# EAGLE design drehgeber_v1 (EAGLE 7.5.0)
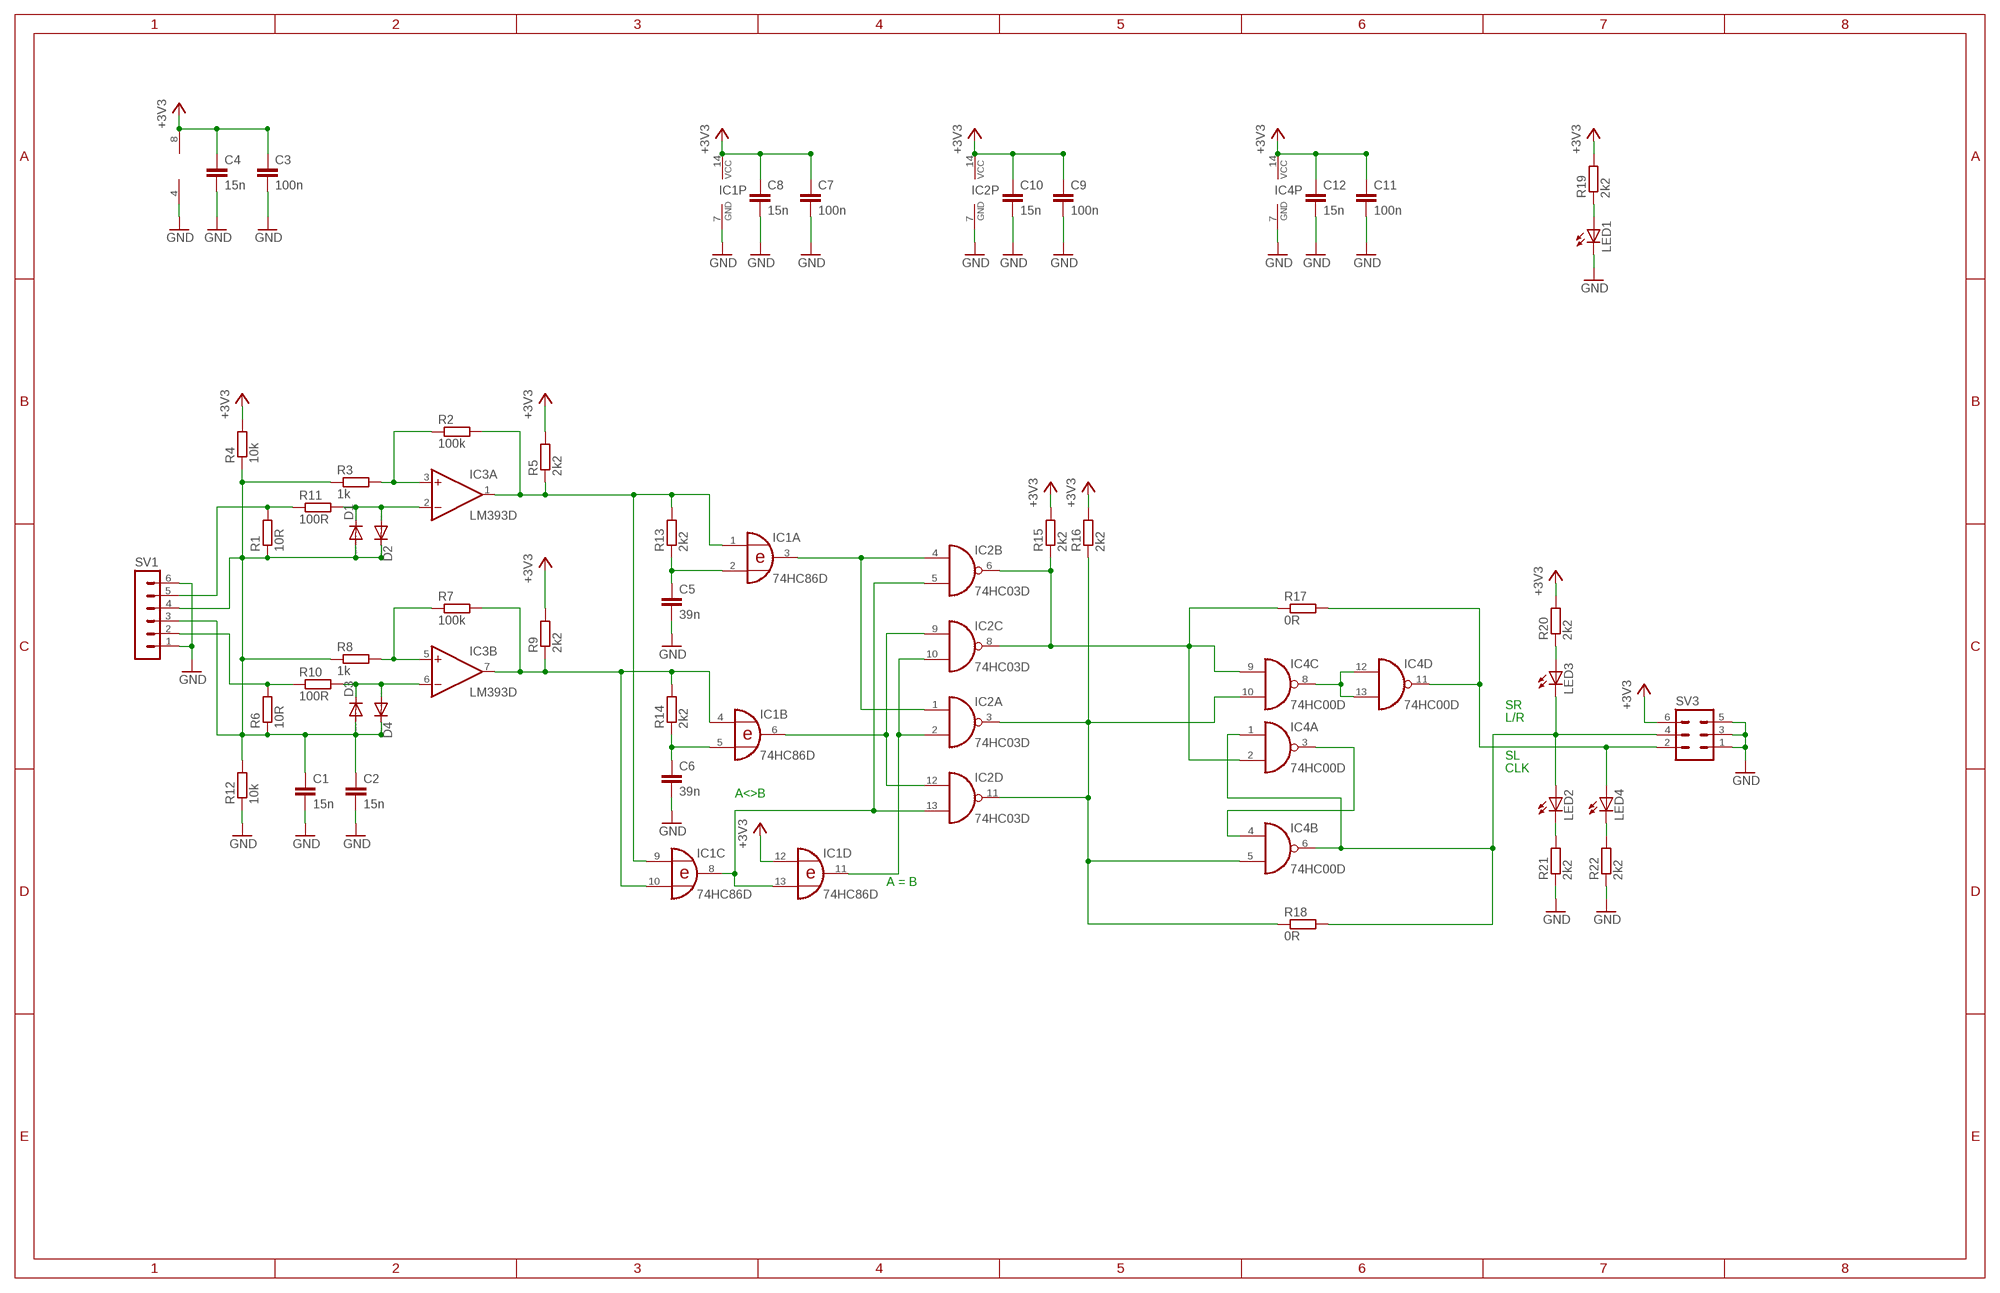
[diagram p0: schematic, sheet 1]

## Parts
C1  15n  C-EUC0805  [C0805]
C2  15n  C-EUC0805  [C0805]
C3  100n  C-EUC0805  [C0805]
C4  15n  C-EUC0805  [C0805]
C5  39n  C-EUC0805  [C0805]
C6  39n  C-EUC0805  [C0805]
C7  100n  C-EUC0805  [C0805]
C8  15n  C-EUC0805  [C0805]
C9  100n  C-EUC0805  [C0805]
C10  15n  C-EUC0805  [C0805]
C11  100n  C-EUC0805  [C0805]
C12  15n  C-EUC0805  [C0805]
D1  DIODE-MINIMELF  [MINIMELF]
D2  DIODE-MINIMELF  [MINIMELF]
D3  DIODE-MINIMELF  [MINIMELF]
D4  DIODE-MINIMELF  [MINIMELF]
IC1  74HC86D  [SO14]
IC2  74HC03D  [SO14]
IC3  LM393D  [SO08]
IC4  74HC00D  [SO14]
LED1  LEDCHIPLED_0805  [CHIPLED_0805]
LED2  LEDCHIPLED_0805  [CHIPLED_0805]
LED3  LEDCHIPLED_0805  [CHIPLED_0805]
LED4  LEDCHIPLED_0805  [CHIPLED_0805]
R1  10R  R-EU_R0805  [R0805]
R2  100k  R-EU_R0805  [R0805]
R3  1k  R-EU_R0805  [R0805]
R4  10k  R-EU_R0805  [R0805]
R5  2k2  R-EU_R0805  [R0805]
R6  10R  R-EU_R0805  [R0805]
R7  100k  R-EU_R0805  [R0805]
R8  1k  R-EU_R0805  [R0805]
R9  2k2  R-EU_R0805  [R0805]
R10  100R  R-EU_R1206  [R1206]
R11  100R  R-EU_R1206  [R1206]
R12  10k  R-EU_R0805  [R0805]
R13  2k2  R-EU_R0805  [R0805]
R14  2k2  R-EU_R0805  [R0805]
R15  2k2  R-EU_R0805  [R0805]
R16  2k2  R-EU_R0805  [R0805]
R17  0R  R-EU_R0805  [R0805]
R18  0R  R-EU_R0805  [R0805]
R19  2k2  R-EU_R0805  [R0805]
R20  2k2  R-EU_R0805  [R0805]
R21  2k2  R-EU_R0805  [R0805]
R22  2k2  R-EU_R0805  [R0805]
SV1  MA06-1  [MA06-1]
SV3  MA03-2  [MA03-2]

## Nets
+3V3: C3.1 C4.1 C7.1 C8.1 C9.1 C10.1 C11.1 C12.1 IC1.12(D:I0) IC1.14(P:VCC) IC2.14(P:VCC) IC3.8(P:V+) IC4.14(P:VCC) R4.2 R5.2 R9.2 R15.2 R16.2 R19.2 R20.2 SV3.6
GND: C1.2 C2.2 C3.2 C4.2 C5.2 C6.2 C7.2 C8.2 C9.2 C10.2 C11.2 C12.2 IC1.7(P:GND) IC3.4(P:V-) IC4.7(P:GND) LED1.C R12.1 R21.1 R22.1 SV1.1 SV1.6 SV3.1 SV3.3 SV3.5
N$1: R1.2 R11.1 SV1.5
N$2: C1.1 C2.1 D1.A D2.C D3.A D4.C R1.1 R3.1 R4.1 R6.1 R8.1 R12.2 SV1.3 SV1.4
N$3: D3.C D4.A IC3.6(B:-IN) R10.2
N$4: IC3.3(A:+IN) R2.1 R3.2
N$5: IC1.1(A:I0) IC1.9(C:I0) IC3.1(A:OUT) R2.2 R5.1 R13.2
N$6: R6.2 R10.1 SV1.2
N$7: D1.C D2.A IC3.2(A:-IN) R11.2
N$8: IC3.5(B:+IN) R7.1 R8.2
N$9: IC1.4(B:I0) IC1.10(C:I1) IC3.7(B:OUT) R7.2 R9.1 R14.2
N$10: C5.1 IC1.2(A:I1) R13.1
N$11: C6.1 IC1.5(B:I1) R14.1
N$12: IC4.11(D:O) LED4.A R17.2 SV3.2
N$13: LED1.A R19.1
N$14: LED4.C R22.2
N$15: IC1.8(C:O) IC1.13(D:I1) IC2.5(B:I1) IC2.13(D:I1)
N$16: IC1.3(A:O) IC2.1(A:I0) IC2.4(B:I0)
N$17: LED2.C R21.2
N$18: IC1.6(B:O) IC2.9(C:I0) IC2.12(D:I0)
N$19: LED3.A R20.1
N$20: IC1.11(D:O) IC2.2(A:I1) IC2.10(C:I1)
N$21: IC2.6(B:O) IC2.8(C:O) IC4.2(A:I1) IC4.9(C:I0) R15.1 R17.1
N$22: IC2.3(A:O) IC2.11(D:O) IC4.5(B:I1) IC4.10(C:I1) R16.1 R18.1
N$25: IC4.8(C:O) IC4.12(D:I0) IC4.13(D:I1)
N$26: IC4.3(A:O) IC4.4(B:I0)
N$27: IC4.1(A:I0) IC4.6(B:O) LED2.A LED3.C R18.2 SV3.4

## Notes on the sheet
- SR
- L/R
- SL
- CLK
- A<>B
- A = B

## Power pins joined to a net without a drawn wire
GND: IC2.7(P:GND)

## Library data of the parts
C1-C12 = rcl:C-EU: CAPACITOR, European symbol
D1-D4 = diode:DIODE-: DIODE
IC1 = 74xx-eu:74*86: Quad 2-input EXCLUSIVE-OR (XOR) gate
IC2 = 74xx-eu:74*03: Quad 2-input NAND gate, open collector output
IC3 = linear:LM393: COMPARATOR
IC4 = 74xx-eu:74*00: Quad 2-input NAND gate
LED1-LED4 = led:LED: LED OSRAM: - CHIPLED LG R971, LG N971, LY N971, LG Q971, LY Q971, LO R971, LY R971 LH N974, LH R974 LS Q976, LO Q976, LY Q976 LO Q996 - Hyper CHIPLED LW Q18S LB Q993, LB Q99A, LB R99A - SideLED LS A670, LO A670, LY A670, LG A670, LP A670 LB A673, LV A673, LT A673, LW A673 LH A674 LY A675 LS A676, LA A676, LO A676, LY A676, LW A676 LS A679, LY A679, LG A679 - Hyper Micro SIDELED® LS Y876, LA Y876, LO Y876, LY Y876 LT Y87S - SmartLED LW L88C, LW L88S LB L89C, LB L89S, LG L890 LS L89K, LO L89K, LY L89K LS L896, LA L896, LO L896, LY L896 - TOPLED LS T670, LO T670, LY T670, LG T670, LP T670 LSG T670, LSP T670, LSY T670, LOP T670, LYG T670 LG T671, LOG T671, LSG T671 LB T673, LV T673, LT T673, LW T673 LH T674 LS T676, LA T676, LO T676, LY T676, LB T676, LH T676, LSB T676, LW T676 LB T67C, LV T67C, LT T67C, LS T67K, LO T67K, LY T67K, LW E67C LS E67B, LA E67B, LO E67B, LY E67B, LB E67C, LV E67C, LT E67C LW T67C LS T679, LY T679, LG T679 LS T770, LO T770, LY T770, LG T770, LP T770 LB T773, LV T773, LT T773, LW T773 LH T774 LS E675, LA E675, LY E675, LS T675 LS T776, LA T776, LO T776, LY T776, LB T776 LHGB T686 LT T68C, LB T68C - Hyper Mini TOPLED® LB M676 - Mini TOPLED Santana® LG M470 LS M47K, LO M47K, LY M47K Source: http://www.osram.convergy.de LUXEON: - LUMILED® LXK2-PW12-R00, LXK2-PW12-S00, LXK2-PW14-U00, LXK2-PW14-V00 LXK2-PM12-R00, LXK2-PM12-S00, LXK2-PM14-U00 LXK2-PE12-Q00, LXK2-PE12-R00, LXK2-PE12-S00, LXK2-PE14-T00, LXK2-PE14-U00 LXK2-PB12-K00, LXK2-PB12-L00, LXK2-PB12-M00, LXK2-PB14-N00, LXK2-PB14-P00, LXK2-PB14-Q00 LXK2-PR12-L00, LXK2-PR12-M00, LXK2-PR14-Q00, LXK2-PR14-R00 LXK2-PD12-Q00, LXK2-PD12-R00, LXK2-PD12-S00 LXK2-PH12-R00, LXK2-PH12-S00 LXK2-PL12-P00, LXK2-PL12-Q00, LXK2-PL12-R00 Source: www.luxeon.com KINGBRIGHT: KA-3528ASYC Source: www.kingbright.com
R1-R22 = rcl:R-EU_: RESISTOR, European symbol
SV1 = con-lstb:MA06-1: PIN HEADER; OC_FARNELL: unknown; OC_NEWARK: unknown
SV3 = con-lstb:MA03-2: PIN HEADER; OC_FARNELL: unknown; OC_NEWARK: unknown

## Board
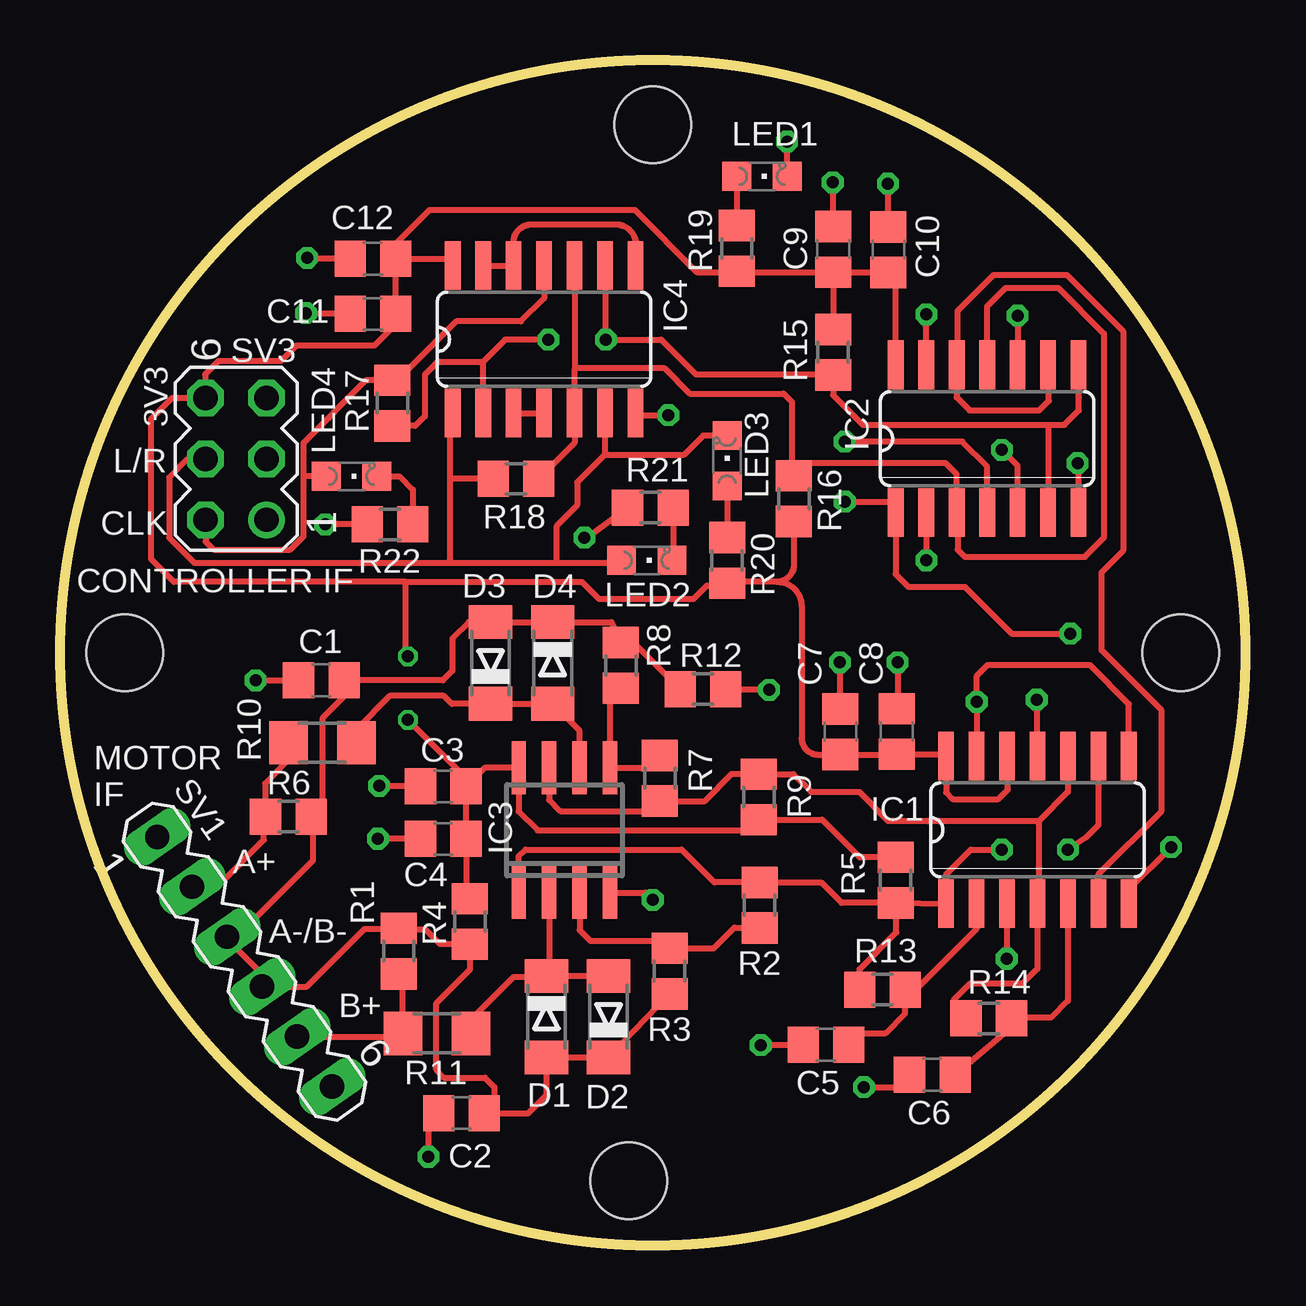
[diagram p1: board, top side]
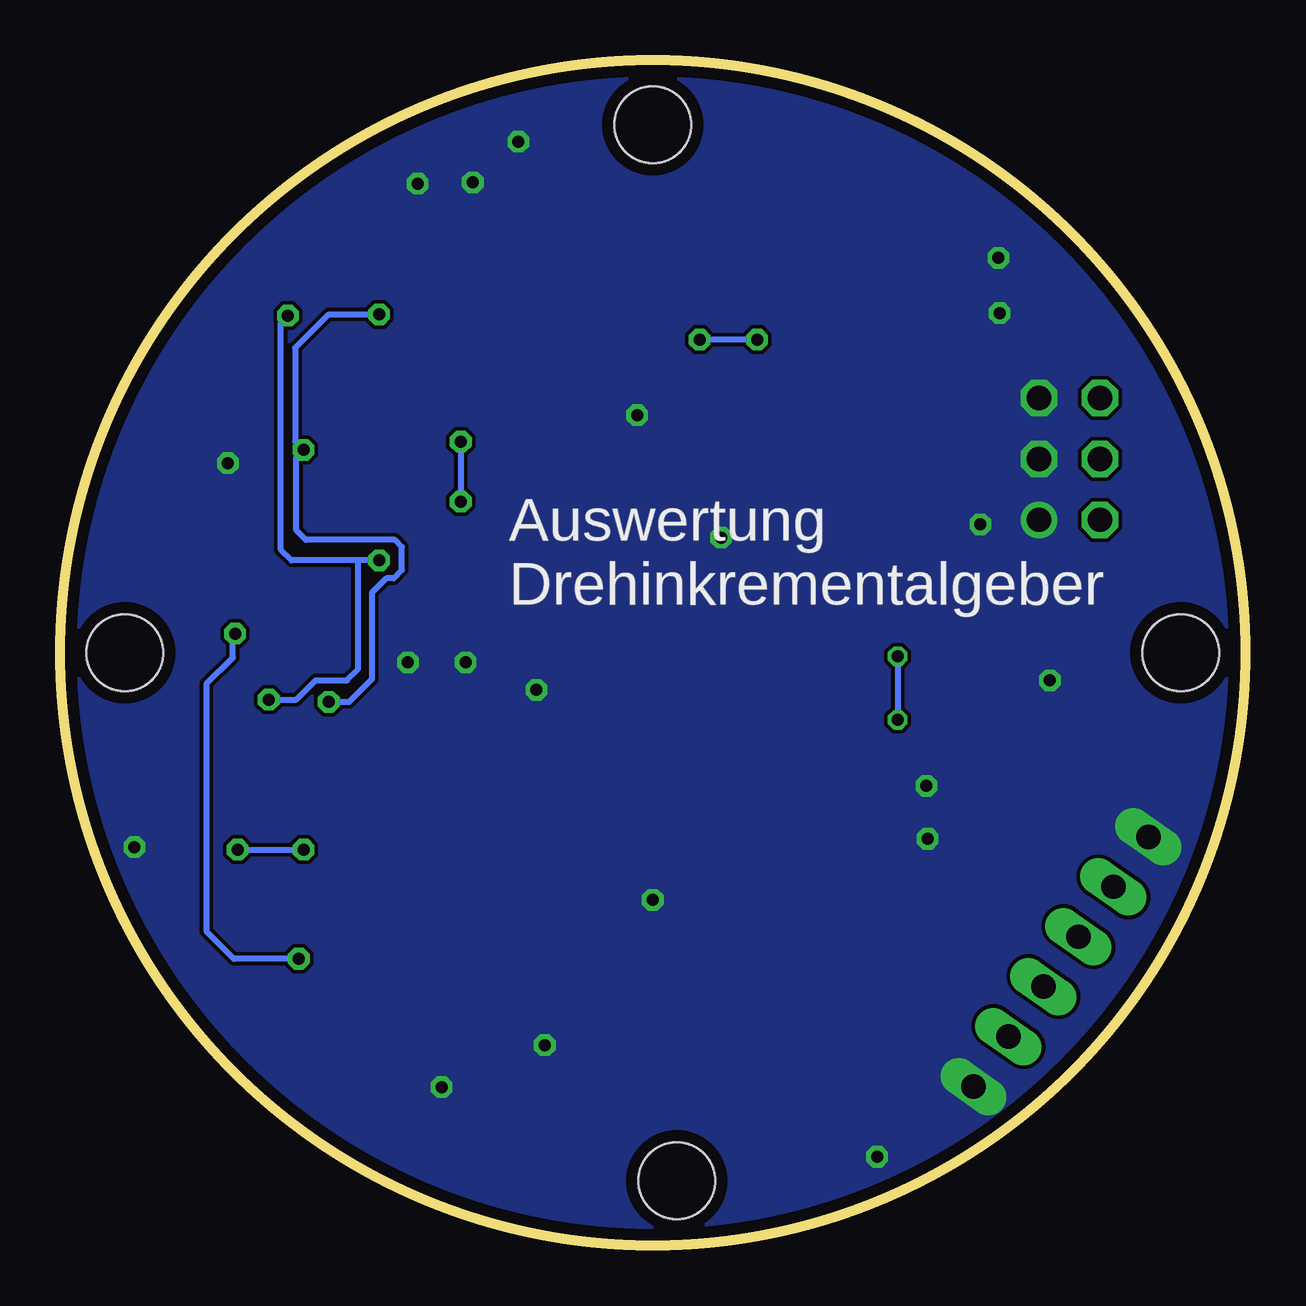
[diagram p2: board, bottom side, seen from below]

Size 49.4 x 49.4 mm. Coordinates in mm from the lower left corner, seen from the top.
Outline: circle at 24.7,24.7 radius 24.7
Copper layers (1*16): Top 0.035mm / dielectric 1.6mm / Bottom 0.035mm
Design rules "Elecrow_2-layer_PCB_eagle_rule": minimum track width 6mil, minimum drill 12mil, track to track 6mil, track to pad 8mil, pad to pad 12mil, via to via 12mil, smd to smd 0mil, copper to edge 20mil, drill to drill 10mil, minimum pad ring 6mil, minimum via ring 6mil, stop-mask expansion 0mil, vias tented up to drill 100mil, thermal gap 10mil
Holes 3.2 mm at 2.7,24.7 46.7,24.7 24.7,46.7 23.7,2.7

### Footprints (pad centres in the part's own frame; a part is rotated, then mirrored left to right if it is on the bottom)
C0805 = smd 1.3 x 1.5: 1 -0.95,0; 2 0.95,0
MINIMELF = smd 1.4 x 1.8: A 1.7,0; C -1.7,0
SO14 = smd 0.66 x 2.032: 1 -3.81,-3.073; 2 -2.54,-3.073; 3 -1.27,-3.073; 4 0,-3.073; 5 1.27,-3.073; 6 2.54,-3.073; 7 3.81,-3.073; 8 3.81,3.073; 9 2.54,3.073; 10 1.27,3.073; 11 0,3.073; 12 -1.27,3.073; 13 -2.54,3.073; 14 -3.81,3.073
SO08 = smd 0.6 x 2.2: 1 -1.905,-2.6; 2 -0.635,-2.6; 3 0.635,-2.6; 4 1.905,-2.6; 5 1.905,2.6; 6 0.635,2.6; 7 -0.635,2.6; 8 -1.905,2.6
CHIPLED_0805 = smd 1.2 x 1.2: A 0,-1.05; C 0,1.05
R0805 = smd 1.3 x 1.5: 1 -0.95,0; 2 0.95,0
R1206 = smd 1.6 x 1.803: 1 -1.422,0; 2 1.422,0
MA06-1 = drill 1.016 long: 1 -6.35,0; 2 -3.81,0; 3 -1.27,0; 4 1.27,0; 5 3.81,0; 6 6.35,0
MA03-2 = drill 1.016: 1 -2.54,-1.27 | drill 1.016 octagon: 2 -2.54,1.27; 3 0,-1.27; 4 0,1.27; 5 2.54,-1.27; 6 2.54,1.27

### Placement (x,y rotation side)
C1  10.89,23.56 180 top
C2  16.73,5.52 180 top
C3  15.97,19.13 180 top
C4  15.97,16.94 180 top
C5  31.92,8.37 180 top
C6  36.35,7.12 180 top
C7  32.52,21.41 90 top
C8  34.87,21.42 90 top
C9  32.22,41.51 90 top
C10  34.52,41.49 90 top
C11  13.04,38.82 180 top
C12  13.04,41.12 180 top
D1  20.27,9.53 270 top
D2  22.86,9.53 90 top
D3  17.94,24.27 90 top
D4  20.53,24.27 270 top
IC1  40.73,17.32 0 top
IC2  38.63,33.62 0 top
IC3  21.02,17.31 0 top
IC4  20.17,37.76 0 top
LED1  29.25,44.55 270 top
LED2  24.45,28.55 270 top
LED3  27.8,32.7 0 top
LED4  12.15,32.05 270 top
R1  14.11,12.27 270 top
R2  29.15,14.18 90 top
R3  25.4,11.43 90 top
R4  17.08,13.5 90 top
R5  34.82,15.22 90 top
R6  9.51,17.87 180 top
R7  25,19.47 270 top
R8  23.37,24.17 270 top
R9  29.12,18.69 270 top
R10  10.94,20.94 0 top
R11  15.71,8.83 0 top
R12  26.79,23.18 180 top
R13  34.27,10.67 180 top
R14  38.7,9.47 180 top
R15  32.22,37.22 90 top
R16  30.58,31.12 270 top
R17  13.85,35.1 90 top
R18  19,31.95 180 top
R19  28.2,41.55 270 top
R20  27.8,28.55 270 top
R21  24.6,30.75 0 top
R22  13.75,30.05 0 top
SV1  7.69,11.83 305 top
SV3  7.34,32.78 90 top

### Tracks (layer width: path | path; a pad name or v marks a point on that pad's centre or on a via)
+3V3  (via drill 0.5)
  Top 0.25: IC1.14 36.92,20.98 36.9,21 | IC1.14 36.92,18.88 37.2,18.6 39.1,18.6 39.5,19 39.5,20.35 IC1.12 | IC3.8 | IC3.8 19.11,18.08 19.9,17.3 29.09,17.3 R9.2 31.75,17.74 33.32,16.17 R5.2 | 29.85,27.65 29.9,27.65 arc-90 30.9,26.65 30.9,21.15 arc90 31.6,20.45 32.51,20.45 arc90 C7.1 34.86,20.46 arc90 C8.1 36.84,20.47 arc-90 IC1.14 | 29.85,27.65 27.85,27.65 R20.2 27.7,27.5 26.95,27.5 26.4,26.95 22.45,26.95 21.75,27.65 14.4,27.65 | 14.4,27.65 4.75,27.65 3.8,28.6 3.8,34.45 4.67,35.32 SV3.6 6.05,35.34 6.05,36.3 6.6,36.85 9.2,36.85 9.85,37.5 13.1,37.5 13.99,38.39 C11.1 C12.1 | IC2.14 34.82,40.24 C10.1 32.24,40.54 C9.1 | C9.1 R15.2 | 28.15,40.56 26.54,40.56 23.95,43.15 15.4,43.15 13.99,41.74 C12.1 | 28.15,40.56 C9.1 | R16.2 30.58,28.38 arc-90 29.85,27.65 | IC3.8 17.69,19.91 C3.1 | C3.1 C4.1 16.92,14.62 R4.2 | 16.9,19.15 C3.1 | v14.5,21.9 16.92,19.48 C3.1 | v14.5,24.55 14.4,24.65 14.4,27.65 | C12.1 16.08,41.12 IC4.14 | R19.2 28.15,40.56
  Bottom 0.25: v14.5,24.55 v14.5,21.9
GND  (via drill 0.5 pad 0.9)
  Top 0.25: IC3.4 24.39,14.71 v24.7,14.4 | IC1.7 44.54,14.84 v46.3,16.6 | IC2.7 42.44,32.56 v42.4,32.6 | C2.2 arc-90 15.35,5.5 v15.35,3.7 | R12.1 29.51,23.18 v29.55,23.15 | v34.9,24.3 34.9,22.4 arc-90 C8.2 | C7.2 32.52,24.28 arc90 v32.5,24.3 | v29.2,8.35 29.22,8.37 C5.2 | v33.5,6.6 34.88,6.6 C6.2 | C3.2 13.32,19.13 v13.3,19.15 | C4.2 v13.26,16.94 v13.25,16.95 | v8.15,23.55 v8.16,23.56 C1.2 | IC4.7 24.07,34.6 v25.35,34.6 | C11.2 10.28,38.82 v10.25,38.85 | C12.2 10.33,41.12 v10.3,41.15 | C9.2 32.22,44.28 v32.2,44.3 | C10.2 34.52,44.23 v34.5,44.25 | R22.1 v11.05,30.05 | R21.1 21.9,29.45 v21.85,29.5 | LED1.C v30.3,46
  pour Bottom (no thermals): -0.3,-0.3 49.7,-0.3 49.7,49.7 -0.3,49.7
N$1
  Top 0.25: SV1.5 14.16,8.71 R11.1 14.28,11.15 R1.2
N$2
  Top 0.25: 18.26,25.76 18.5,26 17.97,26 D3.A | D3.A D4.C 22.99,25.97 R8.1 23.9,25.12 R12.2 | R3.1 22.93,7.91 D2.C D1.A 20.27,6.27 19.5,5.5 18.15,5.5 C2.1 18.1,5.55 18.1,6.6 17.7,7 16,7 15.68,7.31 15.68,10.1 17.08,11.5 R4.1 15.84,12.55 15.25,13.15 14.18,13.15 R1.1 14.1,13.2 12.7,13.2 10.29,10.79 8.95,10.79 | D3.A 17.02,25.97 16.35,25.3 16.35,23.95 15.95,23.55 C1.1 | SV1.4 8.95,10.79 | SV1.3 7.37,12.87 | 7.37,12.87 10.55,16.05 10.55,17.79 R6.1 10.95,18.35 10.95,22 11.8,22.85 11.8,23.52 C1.1 | 7.37,12.87 7.37,12.37 8.95,10.79 | 11.9,23.5 C1.1
N$3
  Top 0.25: 17.86,22.49 D3.C | D3.C D4.A 21.65,21.45 IC3.6 | 12.41,20.9 R10.2 12.36,21.51 13.75,22.9 16,22.9 16.32,22.57 D3.C
N$4
  Top 0.25: IC3.3 21.65,13.14 22.1,12.7 25.08,12.7 R3.2 27.23,12.38 28.1,13.25 29.13,13.25 R2.1
N$5  (via drill 0.5 pad 0.9)
  Top 0.25: IC3.1 19.11,16.21 19.4,16.5 25.9,16.5 27.27,15.13 R2.2 31.71,15.13 32.57,14.27 R5.1 | R5.1 IC1.1 36.92,15.47 37.95,16.5 v39.25,16.5 | IC1.9 43.27,17.52 42.75,17 v42,16.5 | R13.2 33.32,11.52 34.85,13.05 34.85,14.24 R5.1
  Bottom 0.25: v42,16.5 v39.25,16.5
N$6
  Top 0.25: SV1.2 6.55,14.95 8.5,16.9 8.5,17.8 R6.2 8.55,17.89 8.55,19.25 9.52,20.22 R10.1
N$7
  Top 0.25: R11.2 17.13,9.43 18.9,11.2 20.24,11.2 D1.C | D1.C D2.A | IC3.2 20.38,11.35 D1.C
N$8
  Top 0.25: R8.2 22.92,22.78 IC3.5 24.49,19.91 R7.1
N$9
  Top 0.25: IC1.10 42,18.9 40.8,17.7 | 40.8,17.7 40.8,14.32 IC1.4 40.73,11.53 40.1,10.9 37.9,10.9 37.25,10.25 37.25,9.49 R14.2 | 40.8,17.7 34.5,17.7 33.3,18.9 31.3,18.9 30.55,19.64 R9.1 28,19.65 26.87,18.52 R7.2 24.58,18.1 20.85,18.1 20.38,18.56 IC3.7
N$10
  Top 0.25: IC1.2 38.19,13.19 35.67,10.67 R13.1 35.22,9.67 34.4,8.85 33.35,8.85 C5.1
N$11
  Top 0.25: IC1.5 42,10.2 41.3,9.5 40.15,9.5 R14.1 40.1,9.47 C6.1
N$12
  Top 0.25: SV3.2 6.07,29.33 6.4,29 9.6,29 10.15,29.55 10.15,32 | 10.15,32 10.15,33.45 12.75,36.05 R17.2 14.05,36.05 16.51,38.51 19.21,38.51 20.17,39.47 IC4.11 | LED4.A 10.2,32.05 10.15,32
N$13
  Top 0.25: LED1.A R19.1
N$14
  Top 0.25: LED4.C 14.15,32.05 14.7,31.5 R22.2
N$15  (via drill 0.5 pad 0.9)
  Top 0.25: IC1.8 44.54,22.56 42.9,24.2 38.65,24.2 38.2,23.75 v38.2,22.65 IC1.13 | IC2.13 v36.09,38.79 v36.1,38.8 | IC2.5 39.9,32.5 v39.25,33.15
  Bottom 0.25: v36.1,38.8 38.2,38.8 39.6,37.4 39.6,33.5 v39.25,33.15 39.55,32.85 39.55,29.8 39.15,29.4 35.45,29.4 35.15,29.1 35.15,28.15 35.5,27.8 35.8,27.8 36.4,27.2 36.4,23.6 37.35,22.65 v38.2,22.65
N$16  (via drill 0.5 pad 0.9)
  Top 0.25: IC2.4 38.63,32.47 37.6,33.5 v32.7,33.5 | v32.7,31 34.8,31 34.9,31.1 34.9,30.63 IC2.1 34.82,27.98 35.35,27.45 37.7,27.45 39.65,25.5 v42.1,25.5 | IC1.3 v39.46,11.96 v39.45,11.95
  Bottom 0.25: v32.7,33.5 v32.7,31 | v42.1,25.5 42.2,25.4 42.2,24.5 43.3,23.4 43.3,13.1 42.15,11.95 v39.45,11.95
N$17
  Top 0.25: R21.2 25.55,28.6 LED2.C
N$18
  Top 0.25: IC2.9 41.2,36.66 41.2,35.2 40.8,34.8 37.9,34.8 37.36,35.34 IC2.12 37.4,36.73 37.4,38.95 38.9,40.45 41.95,40.45 44.3,38.1 44.3,28.95 43.4,28.05 43.4,24.8 45.9,22.3 45.9,18.1 43.27,15.47 IC1.6
N$19
  Top 0.25: LED3.A R20.1
N$20  (via drill 0.5 pad 0.9)
  Top 0.25: IC2.2 36.09,28.61 v36.1,28.55 | v39.9,38.75 IC2.10 | v40.7,22.75 40.7,20.42 IC1.11
  Bottom 0.25: v39.9,38.75 40.2,38.45 40.2,29 39.75,28.55 37,28.55 | v36.1,28.55 37,28.55 | 37,28.55 37,24 37.45,23.55 38.75,23.55 39.55,22.75 v40.7,22.75
N$21  (via drill 0.5 pad 0.9)
  Top 0.25: IC4.9 22.75,40.79 v22.75,37.75 25.05,37.75 26.5,36.3 32.19,36.3 R15.1 32.22,35.43 33.45,34.2 41.2,34.2 | IC2.6 41.17,34.17 41.2,34.2 | IC2.8 42.44,35.34 42.45,35.33 42.45,34.8 41.85,34.2 41.2,34.2 | v20.35,37.75 18.55,37.75 17.63,36.83 IC4.2 17.63,36.77 17.6,36.8 15.72,36.8 15.2,36.28 15.2,34.55 14.8,34.15 R17.1
  Bottom 0.25: v20.35,37.75 v22.75,37.75
N$22
  Top 0.25: IC4.10 21.44,36.5 | 21.44,36.5 IC4.5 21.44,33.44 R18.1 | 21.44,36.5 21.49,36.55 25.2,36.55 26.25,35.5 30.15,35.5 30.5,35.15 30.5,32.15 R16.1 31.11,32.6 36.9,32.6 37.36,32.14 IC2.3 37.4,30.51 37.4,29 37.7,28.7 42.7,28.7 43.5,29.5 43.5,38 41.6,39.9 39.4,39.9 38.63,39.13 IC2.11
N$25
  Top 0.25: IC4.13 IC4.12 18.9,41.8 arc-90 19.65,42.55 23.15,42.55 arc-90 24,41.7 arc90 23.98,41.68 IC4.8
N$26
  Top 0.25: IC4.3 IC4.4
N$27
  Top 0.25: SV3.4 5.33,32.78 4.55,32 4.55,29.5 5.6,28.45 16.25,28.45 | 16.35,34.68 IC4.1 16.25,34.58 16.25,31.85 | 16.25,28.45 20.7,28.45 | 20.7,28.45 23.3,28.45 LED2.A | 16.25,31.85 16.25,28.45 | LED3.C 26.8,33.75 26.01,32.96 22.71,32.96 | R18.2 16.35,31.95 16.25,31.85 | IC4.6 22.71,32.96 | 22.71,32.96 21.55,31.8 21.55,30.85 20.7,30 20.7,28.45

### Text on the board
tNames: 3V3 | L/R | CLK | CONTROLLER IF | MOTOR / IF | A+ | A-/B- | B+
bNames: Auswertung / Drehinkrementalgeber
tDocu: +3V3 | sld 2016 | C12 | R19 | C9 | C10 | C11 | IC4 | L/R | R15 | L/R | Out | R17 | IC2 | !CLK | R21 | +3V3 | R18 | R16 | !CLK | R22 | L/R | R8 | R20 | R10 | R12 | D3 | D4 | C7 | C8 | C1 | R7 | C3 | IC1 | C4 | R9 | R6 | IC3 | L1 | R4 | R5 | R2 | R1 | R13 | R14 | L2 | R11 | D1 | D2 | R3 | C5 | C6 | C2
bDocu: Drehencoder | Auswerteschaltung